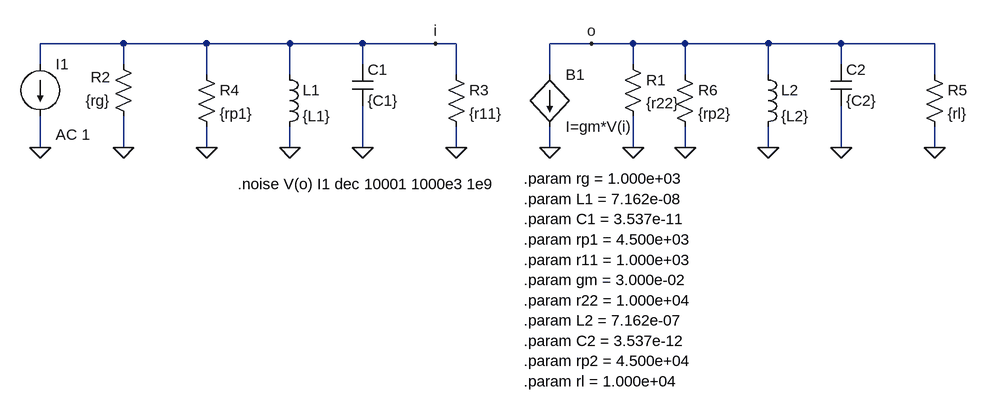
[diagram p0: schematic sintonizado2.asc]
sintonizado2.asc, the LTspice schematic file:
Version 4
SHEET 1 1252 684
WIRE -80 96 -208 96
WIRE 48 96 -80 96
WIRE 176 96 48 96
WIRE 288 96 176 96
WIRE 400 96 288 96
WIRE 432 96 400 96
WIRE 640 96 576 96
WIRE 704 96 640 96
WIRE 784 96 704 96
WIRE 912 96 784 96
WIRE 1024 96 912 96
WIRE 1168 96 1024 96
WIRE -208 128 -208 96
WIRE -80 128 -80 96
WIRE 288 128 288 96
WIRE 704 128 704 96
WIRE 1024 128 1024 96
WIRE 48 144 48 96
WIRE 176 144 176 96
WIRE 432 144 432 96
WIRE 576 144 576 96
WIRE 784 144 784 96
WIRE 912 144 912 96
WIRE 1168 144 1168 96
WIRE -208 256 -208 208
WIRE -80 256 -80 208
WIRE 48 256 48 224
WIRE 176 256 176 224
WIRE 288 256 288 192
WIRE 432 256 432 224
WIRE 576 256 576 224
WIRE 704 256 704 208
WIRE 784 256 784 224
WIRE 912 256 912 224
WIRE 1024 256 1024 192
WIRE 1168 256 1168 224
FLAG -208 256 0
FLAG 288 256 0
FLAG 176 256 0
FLAG 576 256 0
FLAG 432 256 0
FLAG 704 256 0
FLAG 640 96 o
FLAG 400 96 i
FLAG 48 256 0
FLAG -80 256 0
FLAG 1024 256 0
FLAG 912 256 0
FLAG 1168 256 0
FLAG 784 256 0
SYMBOL cap 272 128 R0
SYMATTR InstName C1
SYMATTR Value {C1}
SYMBOL ind 160 128 R0
SYMATTR InstName L1
SYMATTR Value {L1}
SYMATTR SpiceLine Rser=0
SYMBOL res 416 128 R0
SYMATTR InstName R3
SYMATTR Value {r11}
SYMBOL bi 576 144 R0
SYMATTR InstName B1
SYMATTR Value I=gm*V(i)
SYMBOL res 688 112 R0
SYMATTR InstName R1
SYMATTR Value {r22}
SYMBOL res -64 224 R180
WINDOW 0 36 76 Left 2
WINDOW 3 36 40 Left 2
SYMATTR InstName R2
SYMATTR Value {rg}
SYMBOL res 32 128 R0
SYMATTR InstName R4
SYMATTR Value {rp1}
SYMBOL current -208 128 R0
WINDOW 123 24 108 Left 2
WINDOW 39 0 0 Left 2
SYMATTR InstName I1
SYMATTR Value ""
SYMATTR Value2 AC 1
SYMBOL cap 1008 128 R0
SYMATTR InstName C2
SYMATTR Value {C2}
SYMBOL ind 896 128 R0
SYMATTR InstName L2
SYMATTR Value {L2}
SYMATTR SpiceLine Rser=0
SYMBOL res 1152 128 R0
SYMATTR InstName R5
SYMATTR Value {rl}
SYMBOL res 768 128 R0
SYMATTR InstName R6
SYMATTR Value {rp2}
TEXT 96 312 Left 2 !.noise V(o) I1 dec 10001 1000e3 1e9
TEXT 536 304 Left 2 !.param rg = 1.000e+03\n.param L1 = 7.162e-08\n.param C1 = 3.537e-11\n.param rp1 = 4.500e+03\n.param r11 = 1.000e+03\n.param gm = 3.000e-02\n.param r22 = 1.000e+04\n.param L2 = 7.162e-07\n.param C2 = 3.537e-12\n.param rp2 = 4.500e+04\n.param rl = 1.000e+04

The netlist it stands for:
* sintonizado2.asc
C1 i 0 {C1}
L1 i 0 {L1} Rser=0
R3 i 0 {r11}
B1 o 0 I=gm*V(i)
R1 o 0 {r22}
R2 0 i {rg}
R4 i 0 {rp1}
I1 i 0 AC 1
C2 o 0 {C2}
L2 o 0 {L2} Rser=0
R5 o 0 {rl}
R6 o 0 {rp2}
.noise V(o) I1 dec 10001 1000e3 1e9
.param rg = 1.000e+03
.param L1 = 7.162e-08
.param C1 = 3.537e-11
.param rp1 = 4.500e+03
.param r11 = 1.000e+03
.param gm = 3.000e-02
.param r22 = 1.000e+04
.param L2 = 7.162e-07
.param C2 = 3.537e-12
.param rp2 = 4.500e+04
.param rl = 1.000e+04
.backanno
.end